# EAGLE design DSKY_KEY (EAGLE 7.4.0)
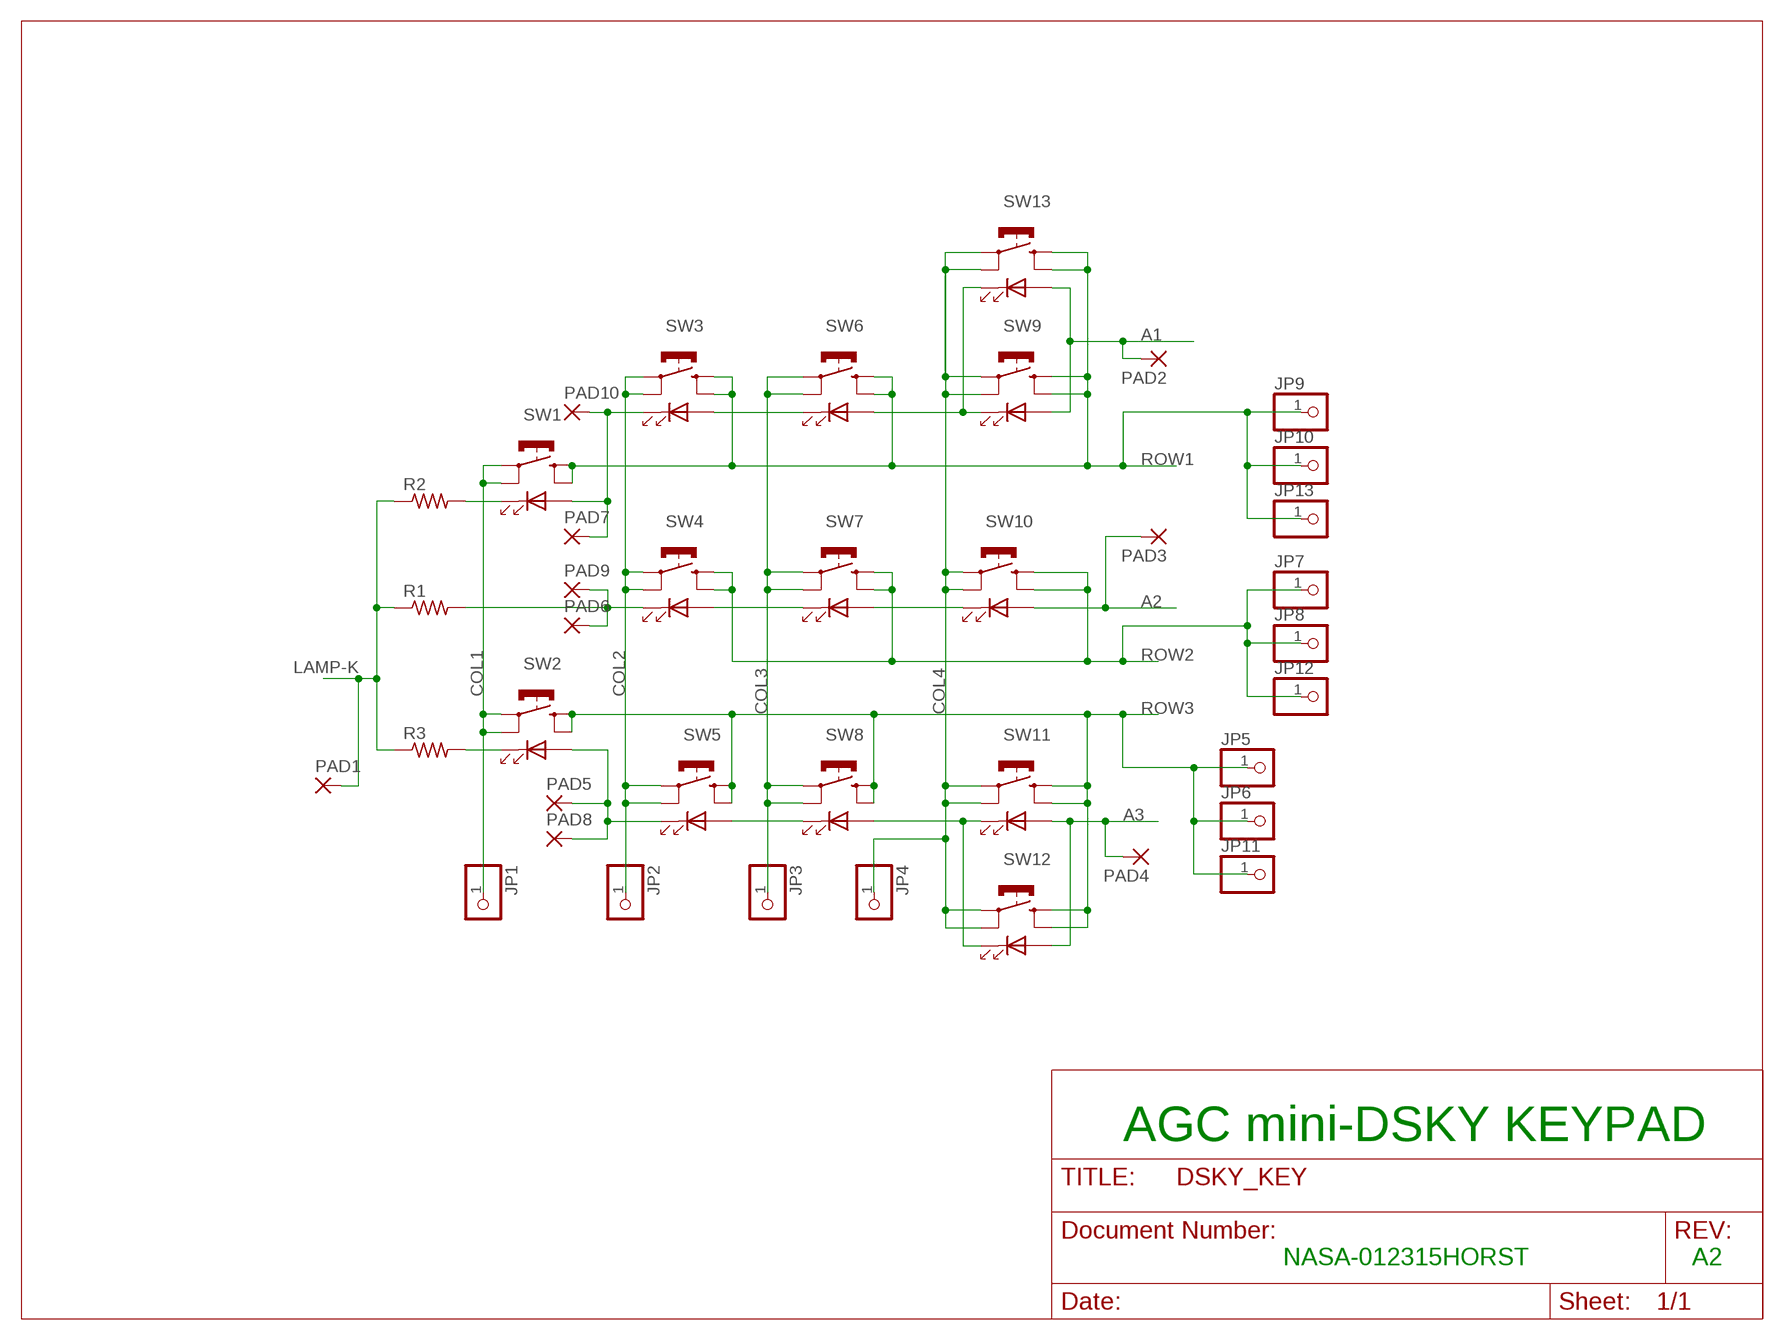
[diagram p0: schematic, sheet 1]

## Parts
JP1  PINHD-1X1  [1X01]
JP2  PINHD-1X1  [1X01]
JP3  PINHD-1X1  [1X01]
JP4  PINHD-1X1  [1X01]
JP5  PINHD-1X1  [1X01]
JP6  PINHD-1X1  [1X01]
JP7  PINHD-1X1  [1X01]
JP8  PINHD-1X1  [1X01]
JP9  PINHD-1X1  [1X01]
JP10  PINHD-1X1  [1X01]
JP11  PINHD-1X1  [1X01]
JP12  PINHD-1X1  [1X01]
JP13  PINHD-1X1  [1X01]
PAD1  2,54/0,8  [2,54/0,8]
PAD2  1,6/0,8  [1,6/0,8]
PAD3  1,6/0,8  [1,6/0,8]
PAD4  1,6/0,8  [1,6/0,8]
PAD5  1,6/0,8  [1,6/0,8]
PAD6  1,6/0,8  [1,6/0,8]
PAD7  1,6/0,8  [1,6/0,8]
PAD8  1,6/0,8  [1,6/0,8]
PAD9  1,6/0,8  [1,6/0,8]
PAD10  1,6/0,8  [1,6/0,8]
R1  R-US_0204/7  [0204/7]
R2  R-US_0204/7  [0204/7]
R3  R-US_0204/7  [0204/7]
SW1  B3E-1100  [B3E-11XX]
SW2  B3E-1100  [B3E-11XX]
SW3  B3E-1100  [B3E-11XX]
SW4  B3E-1100  [B3E-11XX]
SW5  B3E-1100  [B3E-11XX]
SW6  B3E-1100  [B3E-11XX]
SW7  B3E-1100  [B3E-11XX]
SW8  B3E-1100  [B3E-11XX]
SW9  B3E-1100  [B3E-11XX]
SW10  B3E-1100  [B3E-11XX]
SW11  B3E-1100  [B3E-11XX]
SW12  B3E-1100  [B3E-11XX]
SW13  B3E-1100  [B3E-11XX]

## Nets
A1: PAD2.1(P) SW9.P$5(A) SW13.P$5(A)
A2: PAD3.1(P) SW10.P$5(A)
A3: PAD4.1(P) SW11.P$5(A) SW12.P$5(A)
COL1: JP1.1 SW1.P$1(P) SW1.P$2(P1) SW2.P$1(P) SW2.P$2(P1)
COL2: JP2.1 SW3.P$1(P) SW3.P$2(P1) SW4.P$1(P) SW4.P$2(P1) SW5.P$1(P) SW5.P$2(P1)
COL3: JP3.1 SW6.P$1(P) SW6.P$2(P1) SW7.P$1(P) SW7.P$2(P1) SW8.P$1(P) SW8.P$2(P1)
COL4: JP4.1 SW9.P$1(P) SW9.P$2(P1) SW10.P$1(P) SW10.P$2(P1) SW11.P$1(P) SW11.P$2(P1) SW12.P$1(P) SW12.P$2(P1) SW13.P$1(P) SW13.P$2(P1)
LAMP-K: PAD1.1(P) R1.1 R2.1 R3.1
N$1: R2.2 SW1.P$6(K)
N$2: R3.2 SW2.P$6(K)
N$4: PAD6.1(P) PAD9.1(P) R1.2 SW4.P$6(K)
N$5: SW8.P$5(A) SW11.P$6(K) SW12.P$6(K)
N$7: SW6.P$5(A) SW9.P$6(K) SW13.P$6(K)
N$13: SW5.P$5(A) SW8.P$6(K)
N$14: PAD5.1(P) PAD8.1(P) SW2.P$5(A) SW5.P$6(K)
N$15: SW7.P$5(A) SW10.P$6(K)
N$16: SW4.P$5(A) SW7.P$6(K)
N$17: PAD7.1(P) PAD10.1(P) SW1.P$5(A) SW3.P$6(K)
N$18: SW3.P$5(A) SW6.P$6(K)
ROW1: JP9.1 JP10.1 JP13.1 SW1.P$3(S) SW1.P$4(S1) SW3.P$3(S) SW3.P$4(S1) SW6.P$3(S) SW6.P$4(S1) SW9.P$3(S) SW9.P$4(S1) SW13.P$3(S) SW13.P$4(S1)
ROW2: JP7.1 JP8.1 JP12.1 SW4.P$3(S) SW4.P$4(S1) SW7.P$3(S) SW7.P$4(S1) SW10.P$3(S) SW10.P$4(S1)
ROW3: JP5.1 JP6.1 JP11.1 SW2.P$3(S) SW2.P$4(S1) SW5.P$3(S) SW5.P$4(S1) SW8.P$3(S) SW8.P$4(S1) SW11.P$3(S) SW11.P$4(S1) SW12.P$3(S) SW12.P$4(S1)

## Notes on the sheet
- AGC mini-DSKY KEYPAD
- NASA-012315HORST | A2

## Library data of the parts
JP1-JP13 = pinhead:PINHD-1X1: PIN HEADER
PAD1 = wirepad:2,54/0,8: THROUGH-HOLE PAD
PAD2-PAD10 = wirepad:1,6/0,8: THROUGH-HOLE PAD
R1-R3 = rcl:R-US_: RESISTOR, American symbol
SW1-SW13 = OMRON6mm:B3E

## Board
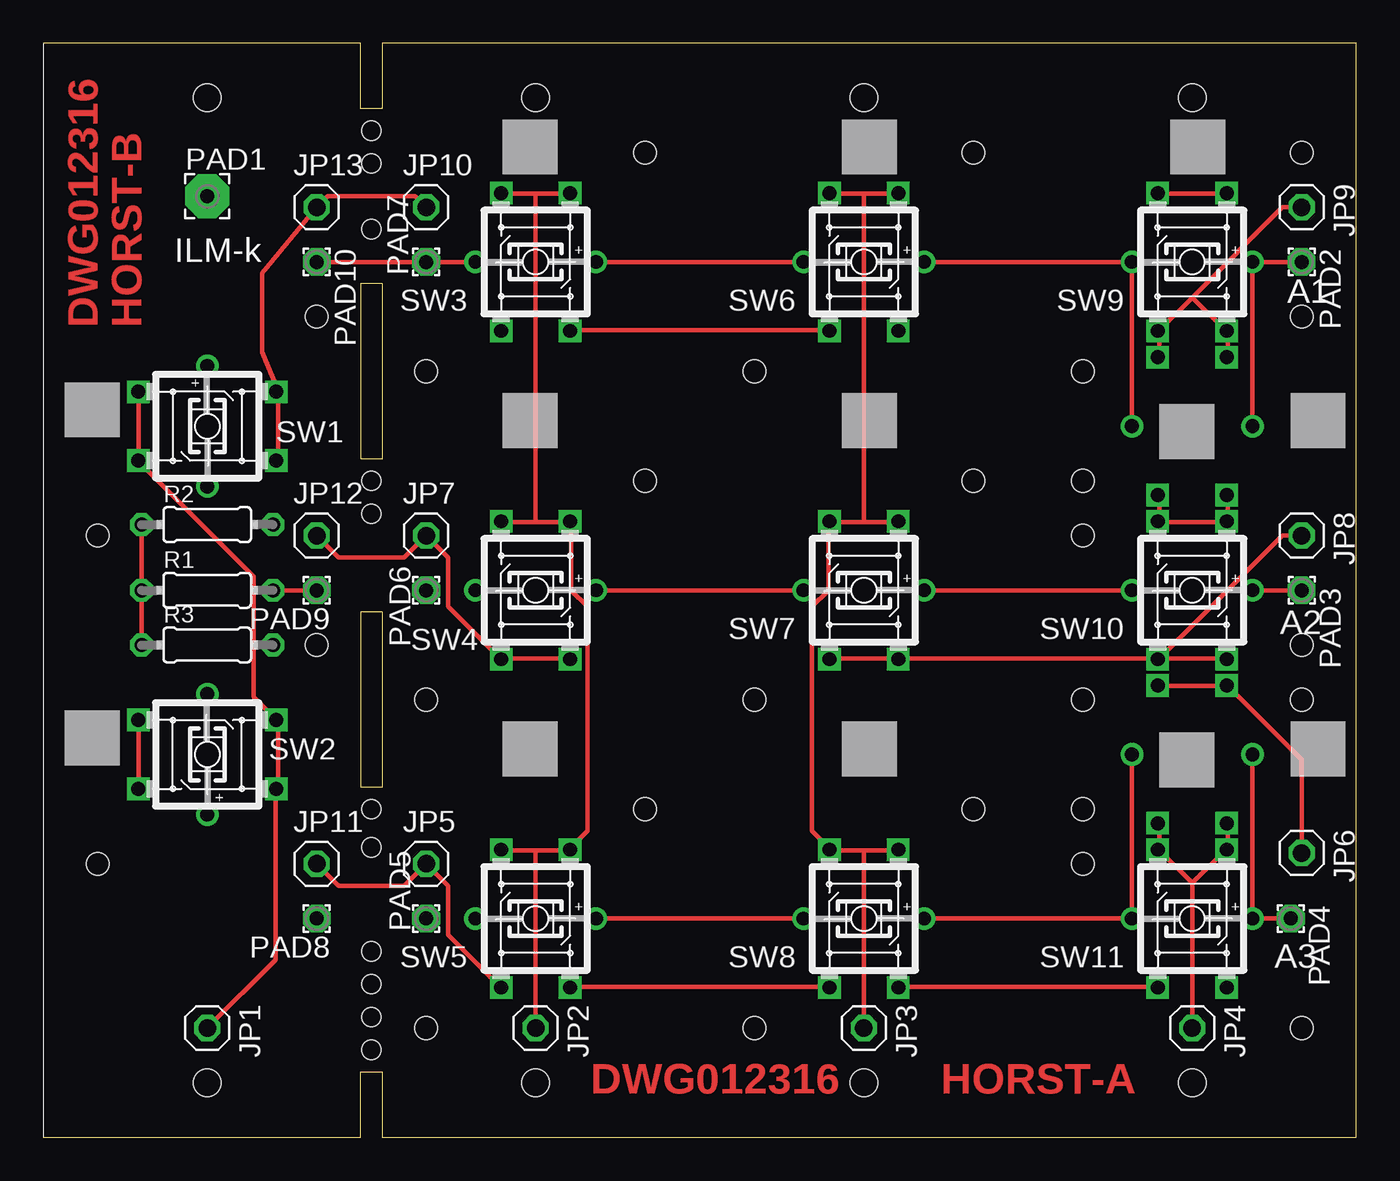
[diagram p1: board, top side]
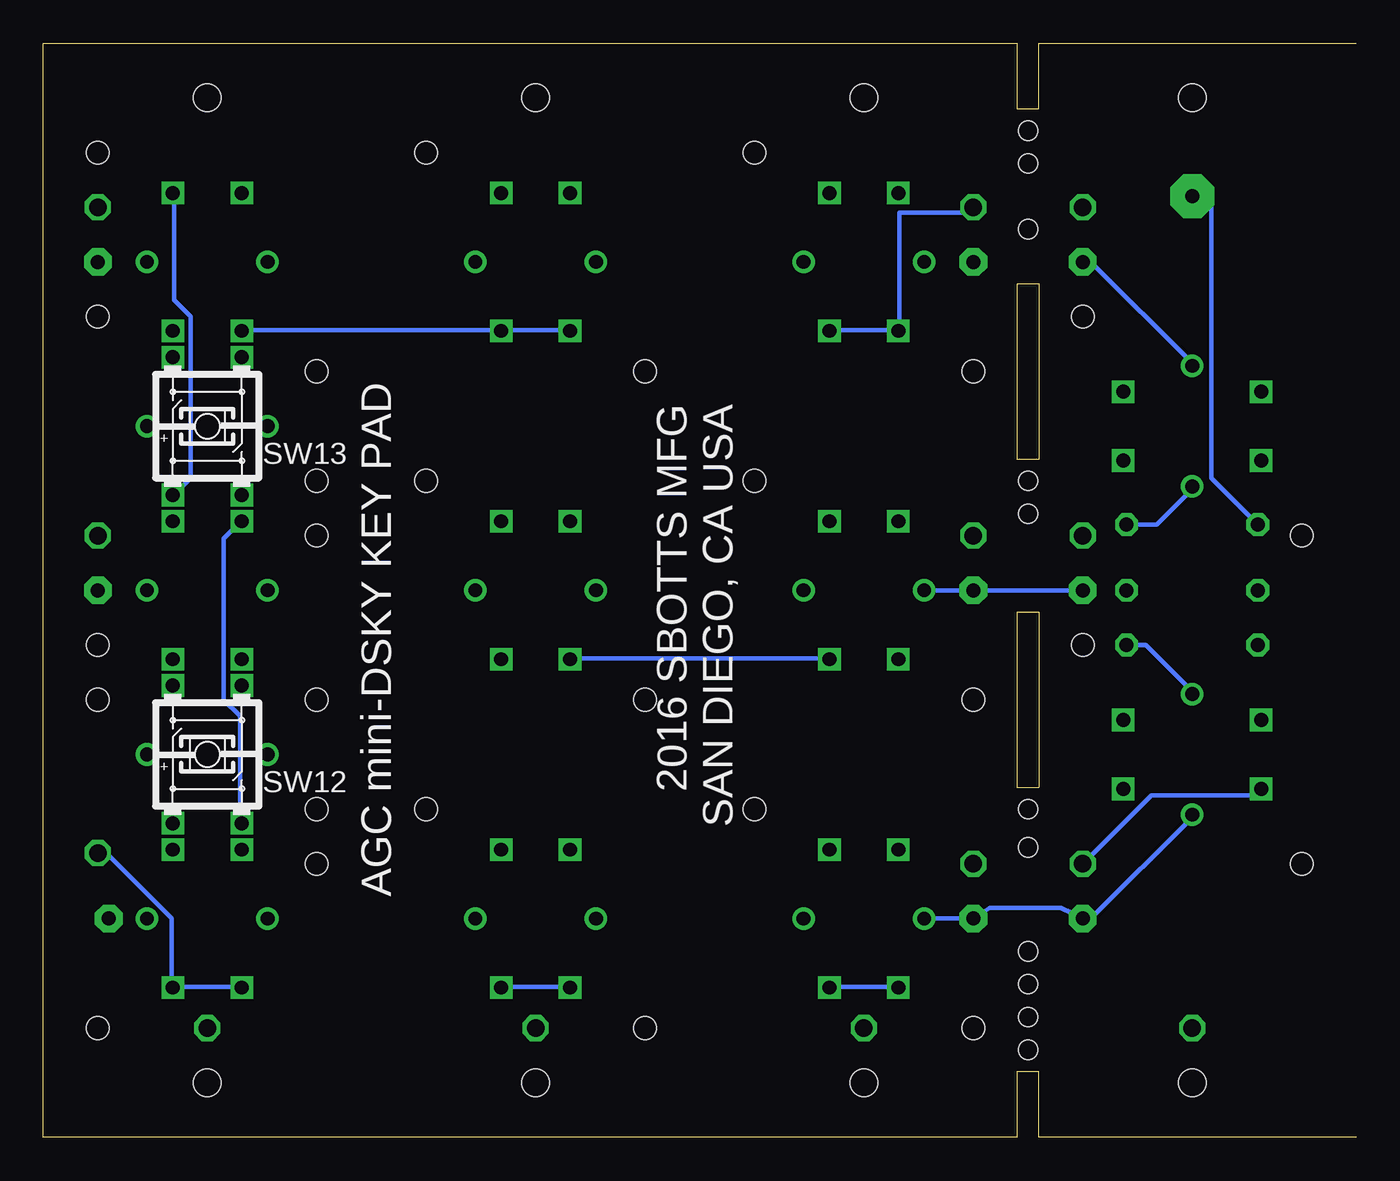
[diagram p2: board, bottom side, seen from below]

Size 76.2 x 63.5 mm. Coordinates in mm from the lower left corner, seen from the top.
Outline: 0,0 18.41,0 18.41,3.81 19.68,3.81 19.68,0 76.2,0 76.2,63.5 19.68,63.5 19.68,59.69 18.41,59.69 18.41,63.5 0,63.5
Outline: 19.68,49.53 18.41,49.53 18.41,39.37 19.68,39.37 19.68,49.53
Outline: 19.68,30.48 18.41,30.48 18.41,20.32 19.68,20.32 19.68,30.48
Copper layers (1*16): Top 0.035mm / dielectric 1.5mm / Bottom 0.035mm
Design rules "default": minimum track width 10mil, minimum drill 24mil, track to track 8mil, track to pad 8mil, pad to pad 8mil, via to via 8mil, smd to smd 8mil, copper to edge 40mil, drill to drill 8mil, minimum pad ring 10mil, minimum via ring 8mil, stop-mask expansion 4mil, vias tented up to drill 0mil, thermal gap 10mil
Holes 1.6 mm at 9.53,3.17 28.57,3.17 47.62,3.17 66.67,3.17 9.53,60.33 28.57,60.33 47.62,60.33 66.67,60.33
Holes 1.1 mm at 19.05,38.1 19.05,16.83 19.05,10.79 19.05,58.42 19.05,6.99 19.05,56.52 19.05,36.2 19.05,52.7 19.05,5.08 19.05,8.89 19.05,19.05
Holes 1.3 mm at 22.23,6.35 34.92,19.05 22.23,25.4 34.92,38.1 22.23,44.45 34.92,57.15 73.03,47.62 53.98,57.15 73.03,57.15 60.33,44.45 60.33,34.92 60.33,25.4 73.03,28.57 73.03,25.4 60.33,15.88 73.03,6.35 41.27,6.35 53.98,19.05 41.27,25.4 53.98,38.1 41.27,44.45 15.88,28.57 3.17,15.88 3.17,34.92 15.88,47.62 60.33,19.05 60.33,38.1

### Footprints (pad centres in the part's own frame; a part is rotated, then mirrored left to right if it is on the bottom)
1X01 = drill 1.016 octagon: 1 0,0
2,54/0,8 = drill 0.813 pad 2.54 octagon: 1 0,0
1,6/0,8 = drill 0.813 pad 1.6 octagon: 1 0,0
0204/7 = drill 0.813 octagon: 1 -3.81,0; 2 3.81,0
B3E-11XX = drill 0.8 square: P$1 -2,-4; P$2 2,-4; P$3 -2,4; P$4 2,4 | drill 0.8: P$5 -3.5,0; P$6 3.5,0

### Placement (x,y rotation side)
JP1  9.53,6.35 270 top
JP2  28.57,6.35 270 top
JP3  47.62,6.35 270 top
JP4  66.67,6.35 270 top
JP5  22.23,15.88 0 top
JP6  73.03,16.51 270 top
JP7  22.23,34.92 0 top
JP8  73.03,34.92 270 top
JP9  73.03,53.98 270 top
JP10  22.23,53.98 0 top
JP11  15.88,15.88 0 top
JP12  15.88,34.92 0 top
JP13  15.88,53.98 0 top
PAD1  9.53,54.61 0 top
PAD2  73.03,50.8 270 top
PAD3  73.03,31.75 180 top
PAD4  72.39,12.7 270 top
PAD5  22.23,12.7 270 top
PAD6  22.23,31.75 180 top
PAD7  22.23,50.8 90 top
PAD8  15.88,12.7 180 top
PAD9  15.88,31.75 180 top
PAD10  15.88,50.8 270 top
R1  9.53,31.75 0 top
R2  9.53,35.56 0 top
R3  9.53,28.57 0 top
SW1  9.53,41.27 270 top
SW2  9.53,22.23 90 top
SW3  28.57,50.8 180 top
SW4  28.57,31.75 180 top
SW5  28.57,12.7 180 top
SW6  47.62,50.8 180 top
SW7  47.62,31.75 180 top
SW8  47.62,12.7 180 top
SW9  66.67,50.8 180 top
SW10  66.67,31.75 180 top
SW11  66.67,12.7 180 top
SW12  66.67,22.23 0 bottom
SW13  66.67,41.27 0 bottom

### Tracks (layer width: path | path; a pad name or v marks a point on that pad's centre or on a via)
A1
  Top 0.254: SW13.P$5 SW9.P$5 PAD2.1
A2
  Top 0.254: PAD3.1 SW10.P$5
A3
  Top 0.254: PAD4.1 SW11.P$5 SW12.P$5
COL1
  Top 0.254: SW1.P$1 5.56,43.18 5.56,39.37 SW1.P$2 5.56,39.21 12.22,32.54 12.22,25.56 13.49,24.29 SW2.P$2 13.65,24.13 13.65,20.32 SW2.P$1 13.49,20.16 13.49,10.32 JP1.1
COL2
  Top 0.254: 28.57,16.67 30.48,16.67 SW5.P$1 30.64,16.83 31.59,17.78 31.59,30.8 30.64,31.75 30.64,35.72 SW4.P$1 30.48,35.72 28.57,35.72 | 28.57,16.67 26.67,16.67 SW5.P$2 | 28.57,16.67 JP2.1 | 28.57,35.72 26.67,35.72 SW4.P$2 | 28.57,54.77 30.48,54.77 SW3.P$1 | 28.57,54.77 26.67,54.77 SW3.P$2 | 28.57,54.77 28.57,35.72
COL3
  Top 0.254: 47.62,16.67 49.53,16.67 SW8.P$1 | 47.62,16.67 45.72,16.67 SW8.P$2 45.56,16.83 44.61,17.78 44.61,30.8 45.56,31.75 45.56,35.72 SW7.P$2 45.72,35.72 47.62,35.72 | 47.62,16.67 JP3.1 | 47.62,35.72 49.53,35.72 SW7.P$1 | 47.62,54.77 49.53,54.77 SW6.P$1 | 47.62,54.77 45.72,54.77 SW6.P$2 | 47.62,54.77 47.62,35.72
COL4
  Top 0.254: SW12.P$1 68.74,18.1 68.74,16.83 SW11.P$1 68.58,16.67 66.67,14.76 | SW12.P$2 64.77,18.1 64.77,16.83 SW11.P$2 64.77,16.67 66.67,14.76 | 66.67,14.76 JP4.1 | SW9.P$2 64.77,54.77 68.58,54.77 SW9.P$1 | SW13.P$2 64.77,37.15 64.77,35.88 SW10.P$2 64.77,35.72 68.58,35.72 SW10.P$1 68.74,35.88 68.74,37.15 SW13.P$1
  Bottom 0.254: SW9.P$1 68.58,54.77 68.58,48.58 67.63,47.62 67.63,38.26 68.58,37.31 SW13.P$1 | SW12.P$2 64.77,18.26 64.77,24.45 65.72,25.4 65.72,34.77 64.77,35.72 SW10.P$2
LAMP-K
  Top 0.254: R3.1 R1.1 R2.1
  Bottom 0.254: R2.1 8.41,38.26 8.41,54.61 PAD1.1
N$1
  Bottom 0.254: R2.2 11.59,35.56 9.53,37.62 SW1.P$6
N$2
  Bottom 0.254: R3.2 12.22,28.57 9.53,25.88 SW2.P$6
N$4
  Top 0.254: PAD9.1 R1.2
  Bottom 0.254: SW4.P$6 PAD6.1 PAD9.1
N$5
  Top 0.254: SW8.P$5 SW11.P$6 63.18,12.7 63.18,22.23 SW12.P$6
N$7
  Top 0.254: SW6.P$5 SW9.P$6 63.18,50.8 63.18,41.27 SW13.P$6
N$13
  Top 0.254: SW8.P$6 SW5.P$5
N$14
  Bottom 0.254: SW5.P$6 PAD5.1 21.27,13.34 17.14,13.34 PAD8.1 15.4,12.7 9.53,18.57 SW2.P$5
N$15
  Top 0.254: SW10.P$6 SW7.P$5
N$16
  Top 0.254: SW7.P$6 SW4.P$5
N$17
  Top 0.254: SW3.P$6 PAD7.1 PAD10.1
  Bottom 0.254: PAD10.1 15.4,50.8 9.53,44.93 SW1.P$5
N$18
  Top 0.254: SW6.P$6 SW3.P$5
ROW1
  Top 0.254: SW1.P$4 13.65,39.37 13.65,43.18 SW1.P$3 13.65,43.34 12.7,45.56 12.7,50.16 JP13.1 16.51,54.61 21.59,54.61 JP10.1 | SW6.P$4 45.56,46.83 30.64,46.83 SW3.P$3 | SW13.P$3 68.74,45.4 68.74,46.67 SW9.P$3 68.58,46.83 66.67,48.74 | SW13.P$4 64.77,45.4 64.77,46.67 SW9.P$4 64.77,46.83 66.67,48.74 | JP9.1 71.91,53.98 66.67,48.74
  Bottom 0.254: SW6.P$4 45.72,46.83 49.53,46.83 SW6.P$3 49.69,46.83 64.61,46.83 SW9.P$4 | SW3.P$3 30.48,46.83 26.67,46.83 SW3.P$4 26.51,46.83 26.51,53.66 22.54,53.66 JP10.1
ROW2
  Top 0.254: SW7.P$4 45.72,27.78 49.53,27.78 SW7.P$3 49.69,27.78 64.61,27.78 SW10.P$4 64.77,27.78 | SW4.P$3 30.48,27.78 26.67,27.78 SW4.P$4 26.51,27.78 23.5,30.8 23.5,33.66 JP7.1 20.95,33.66 17.14,33.66 JP12.1 | 64.77,27.78 68.58,27.78 SW10.P$3 | JP8.1 71.91,34.92 64.77,27.78
  Bottom 0.254: SW7.P$4 45.56,27.78 30.64,27.78 SW4.P$3 | 49.69,27.78 SW7.P$3
ROW3
  Top 0.254: SW2.P$3 5.56,20.32 5.56,24.13 SW2.P$4 | JP11.1 17.14,14.61 20.95,14.61 JP5.1 23.5,14.61 23.5,11.75 26.51,8.73 SW5.P$4 | SW8.P$4 45.56,8.73 30.64,8.73 SW5.P$3 | SW12.P$4 64.77,26.19 68.58,26.19 SW12.P$3 68.74,26.19 73.03,21.91 JP6.1 | SW11.P$4 64.61,8.73 49.69,8.73 SW8.P$3
  Bottom 0.254: SW8.P$4 45.72,8.73 49.53,8.73 SW8.P$3 | SW5.P$4 26.67,8.73 30.48,8.73 SW5.P$3 | JP11.1 11.91,19.84 5.87,19.84 5.56,20.16 SW2.P$3 | SW11.P$4 64.77,8.73 68.58,8.73 SW11.P$3 68.74,8.73 68.74,12.7 72.55,16.51 JP6.1

### Text on the board
Top: DWG012316 | HORST-B | DWG012316 | HORST-A
tPlace: ILM-k | A1 | A2 | A3
bPlace: AGC mini-DSKY KEY PAD | 2016 SBOTTS MFG / SAN DIEGO, CA USA
tStop: DWG012316 | HORST-B | DWG012316 | HORST-A